# EAGLE design control-board-v0.2.1 (EAGLE 8.3.0)
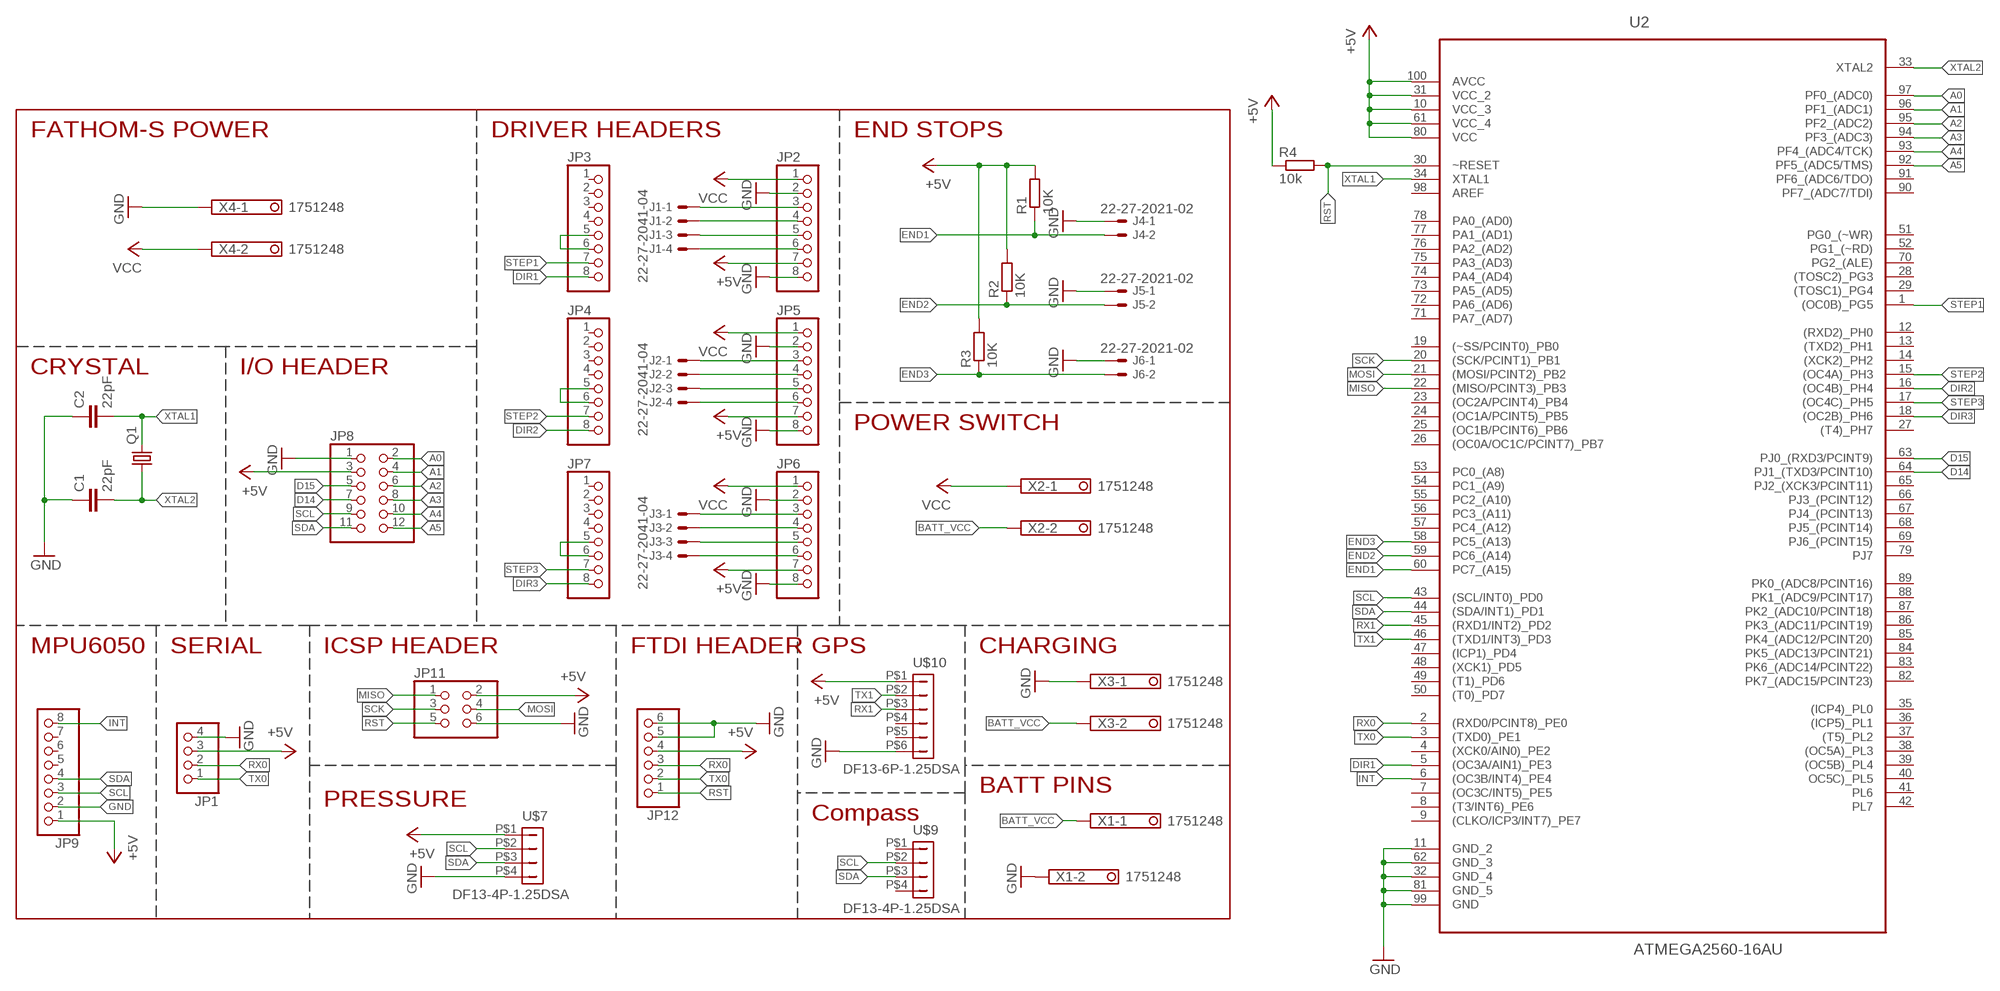
[diagram p0: schematic, sheet 1]

## Parts
C1  22pF  C-EUC0603  [C0603]
C2  22pF  C-EUC0603  [C0603]
J1  22-27-2041-04  [6410-04]
J2  22-27-2041-04  [6410-04]
J3  22-27-2041-04  [6410-04]
J4  22-27-2021-02  [6410-02]
J5  22-27-2021-02  [6410-02]
J6  22-27-2021-02  [6410-02]
JP1  PINHD-1X4  [1X04]
JP2  PINHD-1X8  [1X08]
JP3  PINHD-1X8  [1X08]
JP4  PINHD-1X8  [1X08]
JP5  PINHD-1X8  [1X08]
JP6  PINHD-1X8  [1X08]
JP7  PINHD-1X8  [1X08]
JP8  PINHD-2X6  [2X06]
JP9  PINHD-1X8  [1X08]
JP11  PINHD-2X3  [2X03]
JP12  PINHD-1X6  [1X06]
Q1  CRYSTALHC49U70  [HC49U70]
R1  10K  R-EU_R0603  [R0603]
R2  10K  R-EU_R0603  [R0603]
R3  10K  R-EU_R0603  [R0603]
R4  10k  R-EU_R0603  [R0603]
U2  ATMEGA2560-16AU  [QFP50P1600X1600X120-100N]
U$7  DF13-4P-1.25DSA  [DF13-4P-1.25DSA]
U$9  DF13-4P-1.25DSA  [DF13-4P-1.25DSA]
U$10  DF13-6P-1.25DSA  [DF13-6P-1.25DSA]
X1  1751248  [1751248]
X2  1751248  [1751248]
X3  1751248  [1751248]
X4  1751248  [1751248]

## Nets
+5V: JP1.3 JP2.7 JP5.7 JP6.7 JP8.3 JP9.1 JP11.2 JP12.4 R1.2 R2.2 R3.2 R4.1 U2.10(VCC_3) U2.31(VCC_2) U2.61(VCC_4) U2.80(VCC) U2.100(AVCC) U$7.P$1 U$10.P$1
A0: JP8.2 U2.97(PF0_(ADC0))
A1: JP8.4 U2.96(PF1_(ADC1))
A2: JP8.6 U2.95(PF2_(ADC2))
A3: JP8.8 U2.94(PF3_(ADC3))
A4: JP8.10 U2.93(PF4_(ADC4/TCK))
A5: JP8.12 U2.92(PF5_(ADC5/TMS))
BATT_VCC: X1.1 X2.2 X3.2
D14: JP8.7 U2.64(PJ1_(TXD3/PCINT10))
D15: JP8.5 U2.63(PJ0_(RXD3/PCINT9))
DIR1: JP3.8 U2.5((OC3A/AIN1)_PE3)
DIR2: JP4.8 U2.16((OC4B)_PH4)
DIR3: JP7.8 U2.18((OC2B)_PH6)
END1: J4.2 R1.1 U2.60(PC7_(A15))
END2: J5.2 R2.1 U2.59(PC6_(A14))
END3: J6.2 R3.1 U2.58(PC5_(A13))
GND: C1.1 C2.1 J4.1 J5.1 J6.1 JP1.4 JP2.2 JP2.8 JP5.2 JP5.8 JP6.2 JP6.8 JP8.1 JP9.2 JP11.6 JP12.5 JP12.6 U2.11(GND_2) U2.32(GND_4) U2.62(GND_3) U2.81(GND_5) U2.99(GND) U$7.P$4 U$10.P$6 X1.2 X3.1 X4.1
INT: JP9.8 U2.6((OC3B/INT4)_PE4)
MISO: JP11.1 U2.22((MISO/PCINT3)_PB3)
MOSI: JP11.4 U2.21((MOSI/PCINT2)_PB2)
N$1: JP3.5 JP3.6
N$2: JP4.5 JP4.6
N$3: J1.4 JP2.6
N$4: JP7.5 JP7.6
N$5: J1.3 JP2.5
N$6: J1.2 JP2.4
N$7: J1.1 JP2.3
N$8: J2.4 JP5.6
N$9: J2.3 JP5.5
N$10: J2.2 JP5.4
N$11: J2.1 JP5.3
N$12: J3.4 JP6.6
N$13: J3.3 JP6.5
N$14: J3.2 JP6.4
N$15: J3.1 JP6.3
RST: JP11.5 JP12.1 R4.2 U2.30(~RESET)
RX0: JP1.2 JP12.3 U2.2((RXD0/PCINT8)_PE0)
RX1: U2.45((RXD1/INT2)_PD2) U$10.P$3
SCK: JP11.3 U2.20((SCK/PCINT1)_PB1)
SCL: JP8.9 JP9.3 U2.43((SCL/INT0)_PD0) U$7.P$2 U$9.P$2
SDA: JP8.11 JP9.4 U2.44((SDA/INT1)_PD1) U$7.P$3 U$9.P$3
STEP1: JP3.7 U2.1((OC0B)_PG5)
STEP2: JP4.7 U2.15((OC4A)_PH3)
STEP3: JP7.7 U2.17((OC4C)_PH5)
TX0: JP1.1 JP12.2 U2.3((TXD0)_PE1)
TX1: U2.46((TXD1/INT3)_PD3) U$10.P$2
VCC: JP2.1 JP5.1 JP6.1 X2.1 X4.2
XTAL1: C2.2 Q1.2 U2.34(XTAL1)
XTAL2: C1.2 Q1.1 U2.33(XTAL2)
Unconnected: JP3.1 JP3.2 JP3.3 JP3.4 JP4.1 JP4.2 JP4.3 JP4.4 JP7.1 JP7.2 JP7.3 JP7.4 JP9.5 JP9.6 JP9.7 U2.4((XCK0/AIN0)_PE2) U2.7((OC3C/INT5)_PE5) U2.8((T3/INT6)_PE6) U2.9((CLKO/ICP3/INT7)_PE7) U2.12((RXD2)_PH0) U2.13((TXD2)_PH1) U2.14((XCK2)_PH2) U2.19((~SS/PCINT0)_PB0) U2.23((OC2A/PCINT4)_PB4) U2.24((OC1A/PCINT5)_PB5) U2.25((OC1B/PCINT6)_PB6) U2.26((OC0A/OC1C/PCINT7)_PB7) U2.27((T4)_PH7) U2.28((TOSC2)_PG3) U2.29((TOSC1)_PG4) U2.35((ICP4)_PL0) U2.36((ICP5)_PL1) U2.37((T5)_PL2) U2.38((OC5A)_PL3) U2.39((OC5B)_PL4) U2.40(OC5C)_PL5) U2.41(PL6) U2.42(PL7) U2.47((ICP1)_PD4) U2.48((XCK1)_PD5) U2.49((T1)_PD6) U2.50((T0)_PD7) U2.51(PG0_(~WR)) U2.52(PG1_(~RD)) U2.53(PC0_(A8)) U2.54(PC1_(A9)) U2.55(PC2_(A10)) U2.56(PC3_(A11)) U2.57(PC4_(A12)) U2.65(PJ2_(XCK3/PCINT11)) U2.66(PJ3_(PCINT12)) U2.67(PJ4_(PCINT13)) U2.68(PJ5_(PCINT14)) U2.69(PJ6_(PCINT15)) U2.70(PG2_(ALE)) U2.71(PA7_(AD7)) U2.72(PA6_(AD6)) U2.73(PA5_(AD5)) U2.74(PA4_(AD4)) U2.75(PA3_(AD3)) U2.76(PA2_(AD2)) U2.77(PA1_(AD1)) U2.78(PA0_(AD0)) U2.79(PJ7) U2.82(PK7_(ADC15/PCINT23)) U2.83(PK6_(ADC14/PCINT22)) U2.84(PK5_(ADC13/PCINT21)) U2.85(PK4_(ADC12/PCINT20)) U2.86(PK3_(ADC11/PCINT19)) U2.87(PK2_(ADC10/PCINT18)) U2.88(PK1_(ADC9/PCINT17)) U2.89(PK0_(ADC8/PCINT16)) U2.90(PF7_(ADC7/TDI)) U2.91(PF6_(ADC6/TDO)) U2.98(AREF) U$9.P$1 U$9.P$4 U$10.P$4 U$10.P$5

## Notes on the sheet
- FATHOM-S POWER | DRIVER HEADERS | END STOPS
- CRYSTAL | I/O HEADER
- POWER SWITCH
- MPU6050 | SERIAL | ICSP HEADER | FTDI HEADER | GPS | CHARGING
- BATT PINS
- PRESSURE
- Compass

## Library data of the parts
C1 C2 = rcl:C-EU: CAPACITOR, European symbol
J1-J3 = EP_molex_6410_7395:22-?-04: CONNECTOR wire to board 2.54 mm (.1 inch) pitch header
J4-J6 = EP_molex_6410_7395:22-?-02: CONNECTOR wire to board 2.54 mm (.1 inch) pitch header
JP1 = pinhead:PINHD-1X4: PIN HEADER
JP2-JP7 JP9 = pinhead:PINHD-1X8: PIN HEADER
JP8 = pinhead:PINHD-2X6: PIN HEADER
JP11 = pinhead:PINHD-2X3: PIN HEADER
JP12 = pinhead:PINHD-1X6: PIN HEADER
Q1 = crystal:CRYSTAL: CRYSTAL; OC_FARNELL: unknown; OC_NEWARK: unknown
R1-R4 = rcl:R-EU_: RESISTOR, European symbol
U2 = Atmel_By_element14_Batch_1-00:ATMEGA2560-16AU: Microcontroller; DESCRIPTION: Microcontroller; MPN: ATMEGA2560-16AU; OC_FARNELL: 1288330; OC_NEWARK: 23M5051; PACKAGE: LQFP-100; SUPPLIER: ATMEL
U$7 U$9 = con-hirose-df13-4p:DF13-4P-1.25: DF13-4P 1.25mm Pitch Miniature Crimping Connector.
U$10 = con-hirose-df13-4p:DF13-6P-1.25: DF13-6P 1.25mm Pitch Miniature Crimping Connector.
X1-X4 = con-phoenix-350:1751248: MKDS 1/ 2-3,5 Printklemme Nennstrom: 10 A Bemessungsspannung: 160 V Raster: 3,5 mm Polzahl: 2 Montageart: Löten Anschlussart: Schraubanschluss Anschlussrichtung vom Leiter zur Platine: 0° Source: http://eshop.phoenixcontact.com .. 1751248.pdf; OC_FARNELL: unknown; OC_NEWARK: unknown

## Board
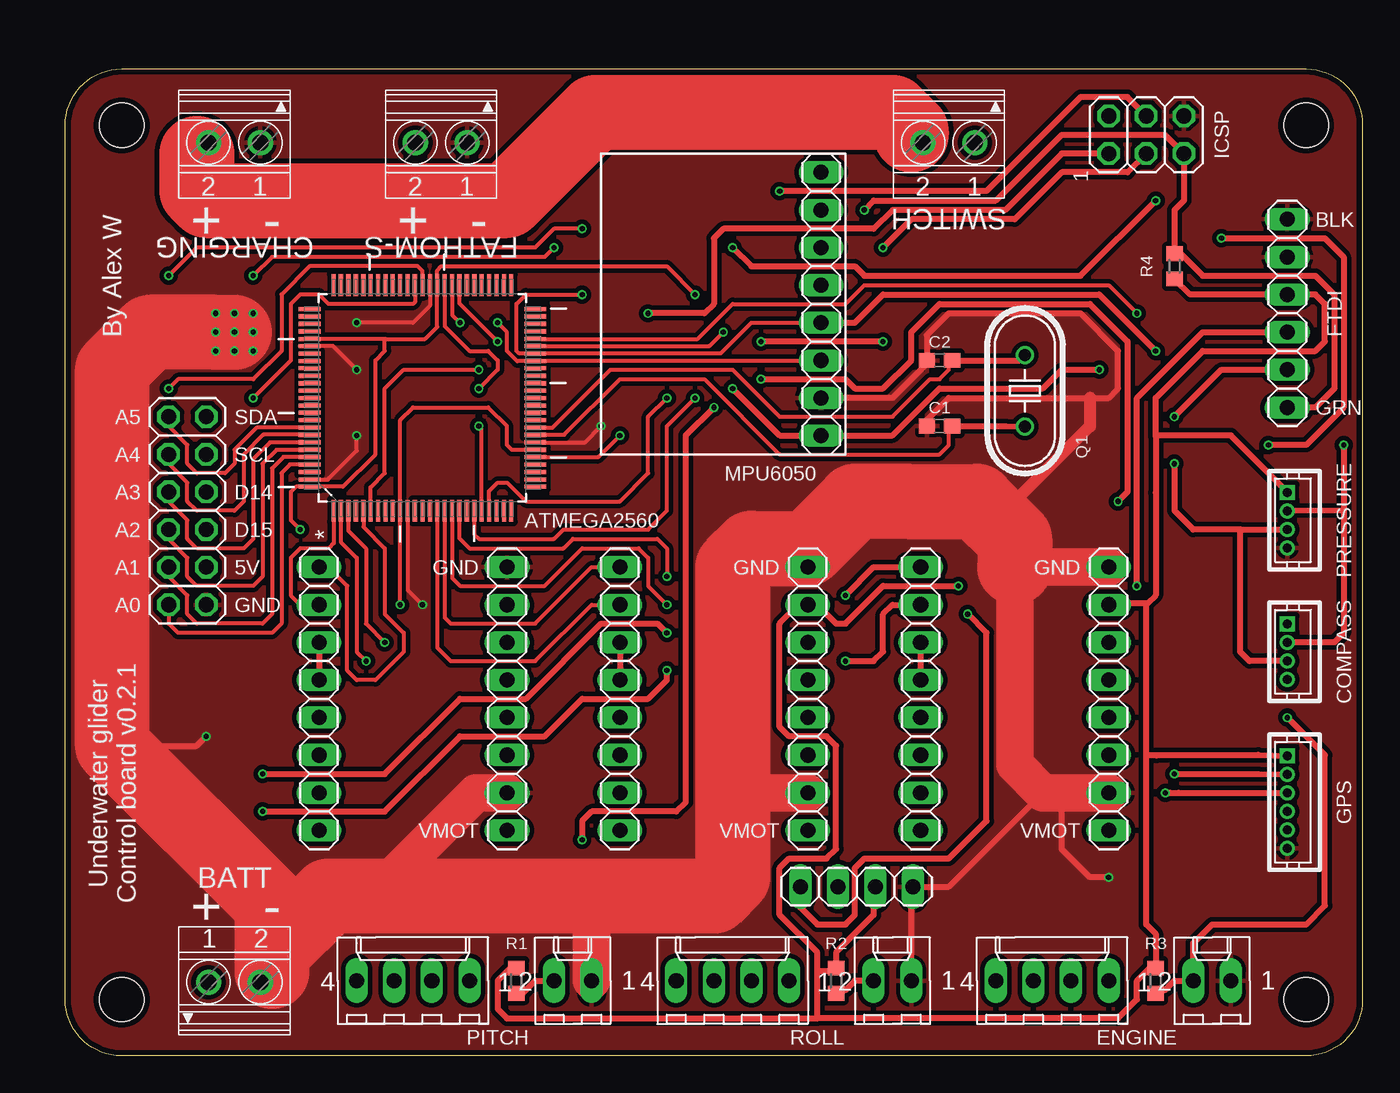
[diagram p1: board, top side]
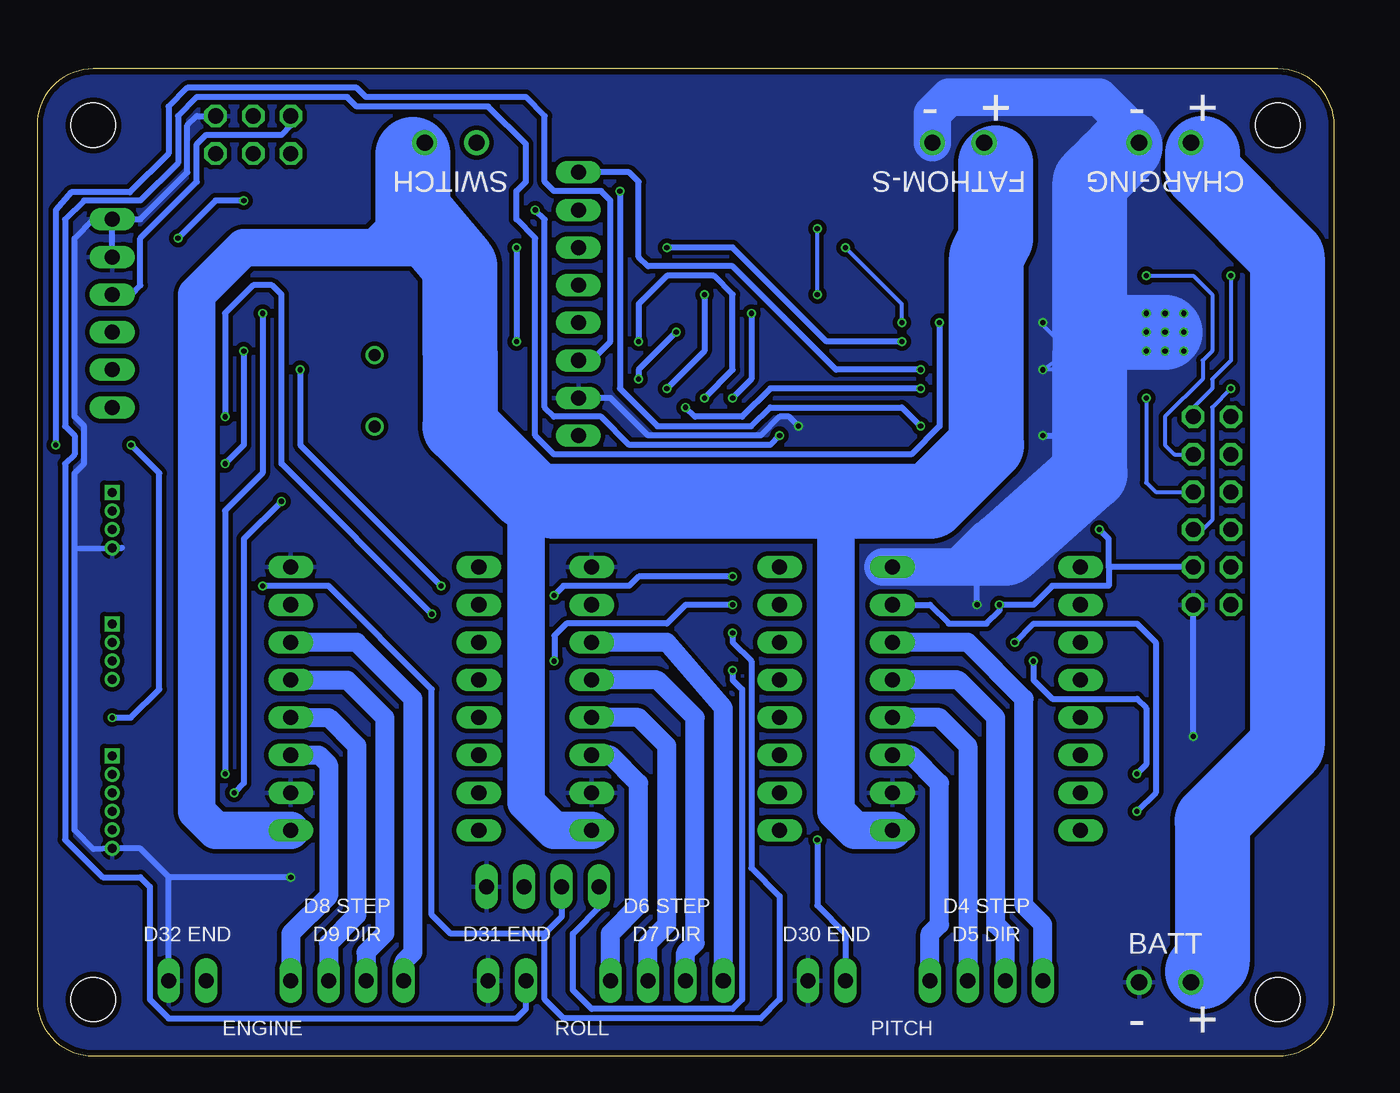
[diagram p2: board, bottom side, seen from below]

Size 87.63 x 66.67 mm. Coordinates in mm from the lower left corner, seen from the top.
Outline: 0,3.81 0,62.87 arc-90 3.81,66.67 83.82,66.67 arc-90 87.63,62.87 87.63,3.81 arc-90 83.82,0 3.81,0 arc-90 0,3.81
Copper layers (1*16): Top 0.035559375mm / dielectric 1.6mm / Bottom 0.035559375mm
Design rules "oshpark-2layer": minimum track width 6mil, minimum drill 10mil, track to track 6mil, track to pad 6mil, pad to pad 6mil, via to via 6mil, smd to smd 6mil, copper to edge 15mil, drill to drill 6mil, minimum pad ring 5mil, minimum via ring 5mil, stop-mask expansion 2.5mil, vias tented up to drill 0mil, thermal gap 10mil
Holes 3 mm at 3.81,3.81 83.82,3.81 3.81,62.87 83.82,62.87

### Footprints (pad centres in the part's own frame; a part is rotated, then mirrored left to right if it is on the bottom)
C0603 = smd 1.1 x 1: 1 -0.85,0; 2 0.85,0
6410-04 = drill 1.016 long: 1 3.81,0; 2 1.27,0; 3 -1.27,0; 4 -3.81,0
6410-02 = drill 1.016 long: 1 1.27,0; 2 -1.27,0
1X04 = drill 1.016 long: 1 -3.81,0; 2 -1.27,0; 3 1.27,0; 4 3.81,0
1X08 = drill 1.016 long: 1 -8.89,0; 2 -6.35,0; 3 -3.81,0; 4 -1.27,0; 5 1.27,0; 6 3.81,0; 7 6.35,0; 8 8.89,0
2X06 = drill 1.016 octagon: 1 -6.35,-1.27; 2 -6.35,1.27; 3 -3.81,-1.27; 4 -3.81,1.27; 5 -1.27,-1.27; 6 -1.27,1.27; 7 1.27,-1.27; 8 1.27,1.27; 9 3.81,-1.27; 10 3.81,1.27; 11 6.35,-1.27; 12 6.35,1.27
2X03 = drill 1.016 octagon: 1 -2.54,-1.27; 2 -2.54,1.27; 3 0,-1.27; 4 0,1.27; 5 2.54,-1.27; 6 2.54,1.27
1X06 = drill 1.016 long: 1 -6.35,0; 2 -3.81,0; 3 -1.27,0; 4 1.27,0; 5 3.81,0; 6 6.35,0
HC49U70 = drill 0.813: 1 -2.413,0; 2 2.413,0
R0603 = smd 1 x 1.1: 1 -0.85,0; 2 0.85,0
QFP50P1600X1600X120-100N = smd 1.473 x 0.279: 1 -7.62,5.994; 2 -7.62,5.512; 3 -7.62,5.004; 4 -7.62,4.496; 5 -7.62,3.988; 6 -7.62,3.505; 7 -7.62,2.997; 8 -7.62,2.489; 9 -7.62,2.007; 10 -7.62,1.499; 11 -7.62,0.991; 12 -7.62,0.508; 13 -7.62,0; 14 -7.62,-0.508; 15 -7.62,-0.991; 16 -7.62,-1.499; 17 -7.62,-2.007; 18 -7.62,-2.489; 19 -7.62,-2.997; 20 -7.62,-3.505; 21 -7.62,-3.988; 22 -7.62,-4.496; 23 -7.62,-5.004; 24 -7.62,-5.512; 25 -7.62,-5.994; 51 7.62,-5.994; 52 7.62,-5.512; 53 7.62,-5.004; 54 7.62,-4.496; 55 7.62,-3.988; 56 7.62,-3.505; 57 7.62,-2.997; 58 7.62,-2.489; 59 7.62,-2.007; 60 7.62,-1.499; 61 7.62,-0.991; 62 7.62,-0.508; 63 7.62,0; 64 7.62,0.508; 65 7.62,0.991; 66 7.62,1.499; 67 7.62,2.007; 68 7.62,2.489; 69 7.62,2.997; 70 7.62,3.505; 71 7.62,3.988; 72 7.62,4.496; 73 7.62,5.004; 74 7.62,5.512; 75 7.62,5.994 | smd 0.279 x 1.473: 26 -5.994,-7.62; 27 -5.512,-7.62; 28 -5.004,-7.62; 29 -4.496,-7.62; 30 -3.988,-7.62; 31 -3.505,-7.62; 32 -2.997,-7.62; 33 -2.489,-7.62; 34 -2.007,-7.62; 35 -1.499,-7.62; 36 -0.991,-7.62; 37 -0.508,-7.62; 38 0,-7.62; 39 0.508,-7.62; 40 0.991,-7.62; 41 1.499,-7.62; 42 2.007,-7.62; 43 2.489,-7.62; 44 2.997,-7.62; 45 3.505,-7.62; 46 3.988,-7.62; 47 4.496,-7.62; 48 5.004,-7.62; 49 5.512,-7.62; 50 5.994,-7.62; 76 5.994,7.62; 77 5.512,7.62; 78 5.004,7.62; 79 4.496,7.62; 80 3.988,7.62; 81 3.505,7.62; 82 2.997,7.62; 83 2.489,7.62; 84 2.007,7.62; 85 1.499,7.62; 86 0.991,7.62; 87 0.508,7.62; 88 0,7.62; 89 -0.508,7.62; 90 -0.991,7.62; 91 -1.499,7.62; 92 -2.007,7.62; 93 -2.489,7.62; 94 -2.997,7.62; 95 -3.505,7.62; 96 -3.988,7.62; 97 -4.496,7.62; 98 -5.004,7.62; 99 -5.512,7.62; 100 -5.994,7.62
DF13-4P-1.25DSA = drill 0.6 pad 1.016 square: P$1 1.875,0 | drill 0.6 pad 1.016: P$2 0.625,0; P$3 -0.625,0; P$4 -1.875,0
DF13-6P-1.25DSA = drill 0.6 pad 1.016 square: P$1 3.125,0 | drill 0.6 pad 1.016: P$2 1.875,0; P$3 0.625,0; P$4 -0.625,0; P$5 -1.875,0; P$6 -3.125,0
1751248 = drill 1.1 pad 1.7: 1 -1.75,-0.1; 2 1.75,-0.1

### Placement (x,y rotation side)
C1  59.05,42.55 0 top
C2  59.05,46.99 0 top
J1  23.49,5.08 0 top
J2  45.09,5.08 0 top
J3  66.67,5.08 0 top
J4  34.29,5.08 0 top
J5  55.88,5.08 0 top
J6  77.47,5.08 0 top
JP1  53.47,11.43 0 top
JP2  29.84,24.13 90 top
JP3  17.14,24.13 90 top
JP4  37.47,24.13 90 top
JP5  50.16,24.13 90 top
JP6  70.48,24.13 90 top
JP7  57.79,24.13 90 top
JP8  8.26,36.83 90 top
JP9  51.05,50.8 90 top
JP11  73.02,62.23 0 top
JP12  82.55,50.16 90 top
Q1  64.83,44.94 90 top
R1  30.48,5.08 90 top
R2  52.07,5.08 90 top
R3  73.66,5.08 90 top
R4  74.93,53.34 90 top
U2  24.13,44.45 90 top
U$7  82.55,36.2 90 top
U$9  82.55,27.3 90 top
U$10  82.55,17.14 90 top
X1  11.43,5.08 0 top
X2  59.69,61.59 180 top
X3  11.43,61.59 180 top
X4  25.4,61.59 180 top

### Tracks (layer width: path | path; a pad name or v marks a point on that pad's centre or on a via)
+5V  (via drill 0.35)
  Top 0.279: v22.63,30.48 U2.10 22.63,42.95 23.49,43.82 28.57,43.82 29.84,42.55 29.84,41.27 30.17,40.95 U2.31 | 21.63,48.44 U2.80 | 21.63,48.44 24.31,48.44 25.12,49.25 U2.61 25.12,53.06 25.4,53.34 40.64,53.34 v42.55,51.44 | 21.63,48.44 21.59,48.4 21.59,47.62 20.95,46.99 20.95,40.64 18.77,38.46 U2.100 15.6,38.46 15.24,38.1 15.24,36.2 v15.88,35.56
  Top 0.406: 50.8,2.54 71.12,2.54 72.39,3.81 72.39,5.08 73.24,5.93 R3.2 73.66,8.26 73.02,8.89 73.02,20.34 | 50.8,2.54 50.8,5.71 | 50.8,2.54 29.84,2.54 29.21,3.17 29.21,5.08 30.06,5.93 R1.2 | 50.8,5.71 52.07,5.71 R2.2 52.07,6.99 54.61,9.53 54.61,11.3 JP1.3 54.61,11.43 | 50.8,5.71 50.8,6.99 48.26,9.53 48.26,12.7 48.9,13.34 51.44,13.34 52.07,13.97 52.07,20.95 51.44,21.59 48.9,21.59 48.26,22.22 48.26,29.21 49.53,30.48 JP5.7 50.8,30.48 52.07,29.21 52.71,29.21 55.25,31.75 v60.33,31.75 | 73.02,20.34 73.02,30.57 | 73.66,38.04 73.66,31.11 73.11,30.57 73.02,30.57 | 73.66,41.87 73.66,38.04 | 73.66,41.87 73.66,44.45 76.83,47.62 84.45,47.62 85.09,48.26 85.09,50.8 84.45,51.44 JP12.4 75.98,51.44 R4.1 | 73.69,38.07 73.66,38.04 | 73.73,20.27 73.02,20.34 | 73.02,20.34 80.58,20.34 U$10.P$1 | 73.02,30.57 70.57,30.57 JP6.7 | U$7.P$1 82.55,38.1 78.74,41.91 73.7,41.91 73.66,41.87 | v69.85,46.36 67.31,46.36 66.04,45.09 59.05,45.09 55.88,41.91 JP9.1 48.26,41.91 v45.09,45.09
  Bottom 0.406: JP2.7 27.3,30.48 26.04,29.21 23.49,29.21 22.63,30.07 v22.63,30.48 20.32,30.48 19.05,31.75 15.24,31.75 15.24,33.02 | 15.24,33.02 15.24,34.93 v15.88,35.56 | JP12.4 81.28,51.44 80.64,52.07 80.64,55.25 76.83,59.05 76.83,61.59 76.2,62.23 71.12,62.23 70.48,62.87 JP11.2 | v69.85,46.36 69.85,41.27 v60.33,31.75 | v42.55,51.44 42.55,47.62 v45.09,45.09 | JP8.3 15.24,33.02
A0
  Top 0.279: U2.97 15.19,39.95 14.61,39.37 14.61,29.21 13.97,28.57 7.62,28.57 6.99,29.21 JP8.2
A1
  Top 0.279: U2.96 14.75,40.46 13.97,39.69 13.97,29.84 13.34,29.21 8.89,29.21 8.26,29.84 8.26,31.11 6.99,32.39 JP8.4
A2
  Top 0.279: U2.95 14.28,40.95 13.34,40.01 13.34,32.39 12.7,31.75 8.89,31.75 8.26,32.39 8.26,33.66 6.99,34.93 JP8.6
A3
  Top 0.279: U2.94 13.83,41.45 12.7,40.32 12.7,34.93 12.06,34.29 8.89,34.29 8.26,34.93 8.26,36.2 6.99,37.47 JP8.8
A4
  Top 0.279: U2.93 13.39,41.96 12.06,40.64 12.06,37.47 11.43,36.83 8.89,36.83 8.26,37.47 8.26,38.73 6.99,40.01 JP8.10
A5
  Top 0.279: U2.92 12.92,42.44 11.43,40.96 11.43,40.01 10.79,39.37 8.89,39.37 8.26,40.01 8.26,41.27 6.99,42.55 JP8.12
BATT_VCC
  Top 0.508: 57.15,62.23 57.69,61.7 X2.2
  Top 2.54: X3.2 8.95,60.96 8.89,60.96
  Top 5.08: 8.89,60.96 8.89,58.42 9.53,57.79 29.84,57.79 35.81,63.75 55.88,63.75 57.15,62.48 57.15,62.23
  Bottom 0.406: 9.53,61.54 X3.2 8.95,60.96 8.89,60.96 | 8.89,5.71 8.95,5.71 X1.1
  Bottom 5.08: 8.89,60.96 8.89,59.69 3.17,53.98 3.17,20.95 8.26,15.88 8.26,6.35 8.89,5.71
D14  (via drill 0.35)
  Top 0.279: U2.64 23.62,50.93 23.49,50.8 17.78,50.8 17.14,51.44 15.88,51.44 15.24,50.8 15.24,46.99 v12.7,44.45
  Bottom 0.279: v12.7,44.45 12.7,38.73 12.06,38.1 JP8.7
D15  (via drill 0.35)
  Top 0.279: U2.63 24.13,53.02 23.81,53.34 16.51,53.34 14.61,51.44 14.61,47.62 12.7,45.72 7.62,45.72 v6.99,45.09
  Bottom 0.279: v6.99,45.09 v6.99,45.08 8.26,43.82 8.26,36.2 8.89,35.56 JP8.5
DIR1
  Top 0.279: U2.5 20.14,35.74 21.59,34.29 21.59,29.84 22.86,28.57 22.86,27.3 20.95,25.4 19.68,25.4 19.05,26.04 19.05,31.75 17.78,33.02 JP3.8
DIR2
  Top 0.279: U2.16 25.63,29.62 26.04,29.21 31.75,29.21 35.56,33.02 JP4.8
DIR3  (via drill 0.35)
  Top 0.279: U2.18 26.62,34.98 27.3,34.29 33.66,34.29 34.29,34.93 40.01,34.93 40.64,34.29 v40.64,32.39
  Top 0.406: v52.71,31.11 54.61,33.02 JP7.8
  Bottom 0.406: v40.64,32.39 46.99,32.39 47.62,31.75 52.07,31.75 v52.71,31.11
END1  (via drill 0.35)
  Top 0.279: U2.60 25.63,49.3 27.3,47.62 28.57,47.62 29.21,46.99 29.21,46.36 v27.94,45.09
  Top 0.406: R1.1 30.9,4.23 31.75,5.08 J4.2 | v43.82,43.82 41.91,41.91 41.91,17.14 41.27,16.51 35.56,16.51 34.93,15.88 v34.93,14.61
  Bottom 0.406: v27.94,45.09 38.1,45.09 40.01,43.18 43.18,43.18 v43.82,43.82 | v34.93,14.61 34.93,10.16 33.02,8.26 J4.2
END2  (via drill 0.35)
  Top 0.279: U2.59 26.14,50.06 v26.67,49.53
  Top 0.406: J5.2 53.34,5.08 52.71,4.45 R2.1
  Bottom 0.406: v26.67,49.53 26.67,42.55 28.57,40.64 52.71,40.64 53.98,41.91 53.98,55.25 55.25,56.52 55.25,58.42 54.61,59.05 54.61,61.59 57.15,64.13 66.04,64.13 66.67,64.77 76.83,64.77 78.1,63.5 78.1,60.33 80.64,57.79 84.45,57.79 85.72,56.52 85.72,42.55 85.09,41.91 85.09,40.64 85.72,40.01 85.72,14.61 83.18,12.06 80.64,12.06 80.01,11.43 80.01,3.81 78.74,2.54 55.25,2.54 54.61,3.17 J5.2
END3  (via drill 0.35)
  Top 0.279: U2.58 26.62,50.85 v29.21,48.26
  Top 0.406: R3.1 74.3,4.45 74.93,5.08 J6.2 76.2,7.62 77.47,8.89 83.82,8.89 85.09,10.16 85.09,20.32 v82.56,22.85 | v78.1,55.25 85.09,55.25 86.36,53.98 86.36,43.82 83.82,41.27 v81.28,41.27 | v45.09,54.61 46.36,53.34 53.34,53.34 53.98,52.71 68.58,52.71 v73.66,57.79
  Bottom 0.406: v29.21,48.26 34.29,48.26 40.64,54.61 v45.09,54.61 | v82.56,22.85 81.29,22.85 79.38,24.76 79.38,39.37 v81.28,41.27 | v73.66,57.79 75.56,57.79 v78.1,55.25
GND  (via drill 0.35)
  Top 0.279: U2.99 17.73,38.94 19.68,40.89 v19.68,41.91 | U2.81 18.08,47.96 v19.68,46.36 | U2.62 24.64,50.67 23.49,49.53 v19.68,49.53 | U2.11 23.14,31.47 v24.13,30.48 | U2.32 35.1,41.45 v36.2,42.55 | v10.16,50.16 v10.16,48.9
  Top 0.406: J5.1 57.15,11.3 JP1.4 59.69,11.43 66.04,17.78 67.31,16.51 67.31,13.97 69.21,12.06 v70.48,12.06 | 56.94,37.51 56.89,37.47 | C1.1 58.21,42.97 59.69,44.45 69.21,44.45 70.48,44.45 71.12,45.09 71.12,47.62 68.58,50.16 59.69,50.16 58.21,48.68 C2.1 58.42,46.99 55.88,44.45 JP9.2 | 62.87,36.2 64.13,34.93 | 3.17,20.95 8.89,20.95 v9.53,21.59
  Top 0.813: 62.87,36.2 69.21,42.55 69.21,44.45
  Top 2.54: X1.2 13.23,4.98 13.97,5.71 | 43.82,10.79 43.82,17.78 JP5.2 | JP2.2 27.74,17.78 20.75,10.79 | J4.1 35.56,10.74 35.62,10.79 | JP5.8 46.36,34.29 | JP6.8 64.77,33.02 64.77,34.29 64.13,34.93 64.13,19.68 66.04,17.78 JP6.2
  Top 5.08: 13.97,5.71 13.97,6.99 | 13.97,6.99 17.78,10.79 20.75,10.79 35.62,10.79 43.82,10.79 45.09,12.06 45.09,33.02 46.36,34.29 50.16,34.29 53.34,37.47 56.89,37.47 61.59,37.47 64.13,34.93 64.13,33.02 | 13.97,6.99 13.97,10.16 3.17,20.95 3.17,46.36 5.71,48.9 v10.16,48.9 v11.43,48.9
  Bottom 0.279: 16.51,47.62 17.78,46.36 v19.68,46.36 17.93,47.62 | 17.93,47.62 16.51,46.84 | v19.68,49.53 19.68,49.38 17.93,47.62 | 24.13,32.99 24.16,33.02
  Bottom 0.406: JP12.6 80.64,56.52 77.47,59.69 77.47,62.87 76.83,63.5 JP11.6 | U$7.P$4 81.88,34.32 85.09,34.29 | 85.09,34.29 85.09,39.37 84.45,40.01 84.45,42.55 85.09,43.18 85.09,55.25 83.82,56.52 JP12.6 | 85.09,34.29 85.09,15.24 83.82,13.97 U$10.P$6 80.65,14.02 78.74,12.11 | J6.1 78.74,12.11 | v19.68,41.91 18.41,41.91 18.41,39.37 16.51,39.37 | v24.13,30.48 24.13,32.99 | 78.74,12.11 70.53,12.11 v70.48,12.06 | v36.2,42.55 36.83,43.18 37.47,43.18 38.73,41.91 46.36,41.91 48.9,44.45 JP9.2 | JP12.5 JP12.6 | v9.53,21.59 JP8.1 | 15.24,60.33 14.55,60.33 X3.1
  Bottom 2.54: 22.22,34.29 22.22,33.02 23.49,33.02 23.49,34.93 25.4,33.02 | 25.4,33.02 24.16,33.02 22.86,33.02 | 25.4,33.02 JP2.8 30.48,33.02 | X3.1 13.18,62.08 15.88,64.77 26.04,64.77 27.15,63.66 X4.1
  Bottom 5.08: 16.51,48.9 16.51,59.05 15.24,60.33 14.12,61.44 | 22.22,34.29 16.51,39.37 16.51,46.84 16.51,47.62 16.51,48.9 | 16.51,48.9 v11.43,48.9
  pour Bottom (isolate 0.305): -5.08,70.48 87.63,70.48 97.16,60.96 97.16,5.08 86.36,-5.71 -1.27,-5.71 -8.26,1.27 -7.62,66.04
  pour Top (isolate 0.305): -6.35,65.41 -1.27,69.21 86.36,69.21 93.34,62.23 93.34,6.35 85.72,-2.54 -1.91,-1.91 -6.35,2.54
INT  (via drill 0.35)
  Top 0.279: U2.6 20.62,38.41 21.59,39.37 21.59,45.09 22.86,46.36 v27.94,46.36
  Bottom 0.406: v27.94,46.36 33.66,46.36 40.64,53.34 46.36,53.34 46.99,53.98 46.99,59.05 47.62,59.69 JP9.8
MISO  (via drill 0.35)
  Top 0.279: U2.22 28.63,38.15 29.21,38.73 29.84,38.73 31.11,37.47 37.47,37.47 39.37,39.37 39.37,43.18 v40.64,44.45
  Top 0.406: JP11.1 67.31,60.96 63.5,57.15 55.88,57.15 54.61,55.88 44.45,55.88 43.82,55.25 43.82,50.8 43.18,50.16 v39.37,50.16
  Bottom 0.406: v39.37,50.16 39.37,45.72 v40.64,44.45
MOSI  (via drill 0.35)
  Top 0.279: U2.21 28.12,42.37 v27.94,42.55
  Top 0.406: JP11.4 71.75,64.77 68.58,64.77 62.23,58.42 v48.26,58.42
  Bottom 0.406: v48.26,58.42 48.26,45.09 45.72,42.55 39.37,42.55 38.1,43.82 29.21,43.82 v27.94,42.55
N$1
  Top 0.406: JP3.6 JP3.5
N$2
  Top 0.406: JP4.6 JP4.5
N$3
  Bottom 1.27: J1.4 19.68,8.89 20.95,10.16 20.95,24.13 24.76,27.94 JP2.6
N$4
  Top 0.406: JP7.6 JP7.5
N$5
  Bottom 1.27: J1.3 22.22,8.26 22.86,8.89 22.86,22.86 25.4,25.4 JP2.5
N$6
  Bottom 1.27: J1.2 24.76,20.95 26.67,22.86 JP2.4
N$7
  Bottom 1.27: J1.1 27.3,8.26 26.67,8.89 26.67,18.41 28.57,20.32 JP2.3
N$8
  Bottom 1.27: J2.4 41.27,23.49 45.09,27.94 JP5.6
N$9
  Bottom 1.27: J2.3 43.82,6.99 43.18,7.62 43.18,22.86 45.72,25.4 JP5.5
N$10
  Bottom 1.27: J2.2 46.36,7.62 45.09,8.89 45.09,20.95 46.99,22.86 JP5.4
N$11
  Bottom 1.27: J2.1 48.9,8.26 46.99,10.16 46.99,18.41 48.9,20.32 JP5.3
N$12
  Bottom 1.27: J3.4 62.87,6.35 62.23,6.99 62.23,24.13 66.04,27.94 JP6.6
N$13
  Bottom 1.27: JP6.5 66.67,25.4 64.13,22.86 64.13,8.26 65.41,6.99 J3.3
N$14
  Bottom 1.27: JP6.4 67.94,22.86 66.04,20.95 66.04,9.53 67.94,7.62 J3.2
N$15
  Bottom 1.27: JP6.3 68.58,20.32 67.94,19.68 67.94,10.79 70.48,8.26 J3.1
N$16  (via drill 0.35)
  other vias: 11.43,50.16
N$17  (via drill 0.35)
  other vias: 12.7,50.16
N$18  (via drill 0.35)
  other vias: 10.16,47.62
N$19  (via drill 0.35)
  other vias: 12.7,47.62
N$20  (via drill 0.35)
  other vias: 12.7,48.9
N$21  (via drill 0.35)
  other vias: 11.43,47.62
N$23
  pour Top (isolate 0.305): 3.81,66.67 83.82,66.67 arc-90 87.63,62.87 87.63,3.81 arc-90 83.82,0 3.81,0 arc-90 0,3.81 0,62.87 arc-90
N$24
  pour Bottom (isolate 0.305): 3.81,66.67 83.82,66.67 arc-90 87.63,62.87 87.63,3.81 arc-90 83.82,0 3.81,0 arc-90 0,3.81 0,62.23 arc-90
RST  (via drill 0.35)
  Top 0.279: U2.30 36.02,40.46 v37.47,41.91
  Top 0.406: JP12.1 84.45,43.82 85.72,45.09 85.72,51.44 84.45,52.71 76.83,52.71 75.35,54.19 R4.2 74.93,57.15 75.56,57.79 JP11.5 74.3,62.23 67.31,62.23 62.87,57.79 54.61,57.79 v53.98,57.15
  Bottom 0.406: v37.47,41.91 38.1,41.27 47.62,41.27 49.53,43.18 52.71,43.18 53.34,43.82 53.34,56.52 v53.98,57.15
RX0  (via drill 0.35)
  Top 0.279: U2.2 18.62,34.72 19.68,33.66 19.68,27.3 v20.32,26.67
  Top 0.406: v72.39,31.75 72.39,44.45 76.83,48.9 JP12.3 | v13.34,19.05 21.59,19.05 26.67,24.13 31.11,24.13 36.2,29.21 40.01,29.21 v40.64,28.57
  Bottom 0.406: JP1.2 52.2,9.4 53.34,8.26 53.4,8.26 | 53.4,8.26 59.69,8.26 60.96,9.53 60.96,24.76 67.94,31.75 v72.39,31.75 | v20.32,26.67 20.32,25.4 19.05,24.13 13.34,24.13 12.7,23.49 12.7,19.68 v13.34,19.05 | v40.64,28.57 40.64,27.94 39.37,26.67 39.37,12.7 37.47,10.79 37.47,3.81 38.73,2.54 52.07,2.54 53.34,3.81 53.34,8.19 53.4,8.26
RX1  (via drill 0.35)
  Top 0.279: U2.45 43.51,47.96 v44.45,48.9
  Top 0.406: v46.99,45.72 52.71,45.72 53.34,45.09 55.25,45.09 57.15,46.99 57.15,48.9 59.05,50.8 69.21,50.8 71.75,48.26 71.75,38.1 v71.12,37.47 | v74.32,17.78 74.63,17.78 74.66,17.76 75.2,17.76 75.21,17.77 U$10.P$3
  Bottom 0.406: v44.45,48.9 46.99,46.36 v46.99,45.72 | v71.12,37.47 73.66,34.93 73.66,18.41 74.3,17.78 v74.32,17.78
SCK  (via drill 0.35)
  Top 0.279: U2.20 27.63,35.23 27.94,34.93 33.02,34.93 33.66,35.56 39.37,35.56 40.64,36.83 40.64,42.55 v42.55,44.45
  Top 0.406: JP11.3 71.75,59.69 67.31,59.69 64.13,56.52 57.15,56.52 v55.25,54.61 | v55.25,48.26 v46.99,48.26
  Bottom 0.406: v42.55,44.45 40.64,46.36 40.64,51.44 41.91,52.71 45.09,52.71 46.99,50.8 v46.99,48.26 | v55.25,54.61 v55.25,48.26
SCL  (via drill 0.35)
  Top 0.279: JP9.3 51,46.94 U2.43 30.53,46.94 29.84,47.62 29.84,48.9 v29.21,49.53 | v33.02,54.61 32.39,53.98 13.97,53.98 v12.7,52.71
  Top 0.406: U$7.P$2 86.36,36.83 | 86.36,36.83 86.36,28.57 85.72,27.94 U$9.P$2 | v86.36,41.27 86.36,36.83
  Bottom 0.279: v29.21,49.53 29.21,50.8 v33.02,54.61 | v12.7,52.71 9.53,52.71 8.26,51.44 8.26,47.62 8.89,46.99 8.89,45.72 11.43,43.18 11.43,41.27 10.79,40.64 JP8.9
  Bottom 0.406: JP9.3 50.16,46.99 48.9,48.26 48.9,57.79 49.53,58.42 52.71,58.42 53.34,59.05 53.34,63.5 54.61,64.77 65.41,64.77 66.04,65.41 77.47,65.41 78.74,64.13 78.74,60.96 81.36,58.34 85.32,58.34 86.36,57.15 v86.36,41.27
SDA  (via drill 0.35)
  Top 0.279: JP9.4 46.36,49.53 44.27,47.45 U2.44 30.66,47.45 30.48,47.62 30.48,50.8 31.11,51.44 v34.93,51.44 | v34.93,55.88 33.02,55.88 31.75,54.61 8.89,54.61 v6.99,52.71
  Top 0.406: JP9.4 53.34,49.53 55.25,51.44 69.85,51.44 v73.66,47.62 | v74.93,40.01 74.93,36.83 76.2,35.56 79.44,35.56 | 79.44,35.56 U$7.P$3 | U$9.P$3 80,26.68 79.38,27.3 79.38,35.5 79.44,35.56
  Bottom 0.279: v34.93,51.44 v34.93,55.88 | v6.99,52.71 6.99,46.99 8.26,45.72 8.26,45.09 9.53,43.82 JP8.11
  Bottom 0.406: v73.66,47.62 73.66,41.27 v74.93,40.01
STEP1
  Top 0.279: U2.1 18.14,34.65 17.78,34.29 15.88,34.29 15.24,33.66 15.24,31.11 15.88,30.48 JP3.7
STEP2
  Top 0.279: U2.15 25.12,27.58 26.04,26.67 31.75,26.67 35.56,30.48 JP4.7
STEP3  (via drill 0.35)
  Top 0.279: U2.17 26.14,32.28 26.67,31.75 32.39,31.75 34.93,34.29 38.73,34.29 39.37,33.66 39.37,31.75 v40.64,30.48
  Top 0.406: v52.71,26.67 54.61,26.67 55.25,27.3 55.25,29.84 55.88,30.48 JP7.7
  Bottom 0.406: v40.64,30.48 43.82,30.48 45.09,29.21 51.87,29.21 52.68,28.4 52.68,26.69 v52.71,26.67
TX0  (via drill 0.35)
  Top 0.279: U2.3 19.13,35.48 20.32,34.29 20.32,29.21 v21.59,27.94
  Top 0.406: JP1.1 49.66,10.03 50.8,8.89 52.71,8.89 53.34,9.53 53.34,12.7 53.98,13.34 59.69,13.34 62.23,15.88 62.23,28.57 v60.96,29.84 | v74.93,43.18 78.1,46.36 JP12.2 | v13.34,16.51 21.59,16.51 26.67,21.59 32.39,21.59 34.93,24.13 39.37,24.13 40.64,25.4 v40.64,26.04
  Bottom 0.406: v60.96,29.84 71.12,40.01 71.12,51.44 71.75,52.07 73.02,52.07 74.93,50.16 v74.93,43.18 | v21.59,27.94 20.32,29.21 13.34,29.21 12.06,27.94 12.06,17.78 v13.34,16.51 | v40.64,26.04 40.64,25.4 40.01,24.76 40.01,3.81 40.64,3.17 50.16,3.17 51.44,4.45 51.44,8.26 49.53,10.16 49.53,11.3 JP1.1
TX1  (via drill 0.35)
  Top 0.279: U2.46 42.72,48.44 45.09,50.8 52.71,50.8 53.98,52.07 70.48,52.07 v72.39,50.16
  Top 0.406: v74.93,19.05 80.61,19.05 U$10.P$2
  Bottom 0.406: v72.39,50.16 72.39,39.37 74.93,36.83 v74.93,19.05
VCC
  Bottom 0.305: 33.66,37.47 27.3,37.47
  Bottom 0.406: 52.71,37.47 54.61,38.1 | 60.87,55.34 60.93,55.28 | 60.72,55.34 60.87,55.34 | 60.87,55.34 64.04,55.34 64.77,54.61 | 62.23,57.15 62.23,55.25 61.59,54.61 | 60.8,55.28 60.93,55.28 | 60.93,55.28 61.59,54.61 | 61.59,54.61 62.23,53.98 | 60.67,55.28 60.8,55.28 | 60.8,55.28 60.87,55.34 | 60.93,55.28 62.25,55.28 62.92,54.61 | 57.15,42.55 59.05,44.45 59.05,47.62 57.15,45.72 57.15,42.55 | 57.15,42.55 57.15,41.91 | 22.86,60.33 22.91,60.96 X4.2
  Bottom 2.54: JP2.1 32.39,15.24 33.66,16.51 33.66,37.47 | JP5.1 52.71,15.24 54.61,17.14 54.61,38.1 | 62.23,60.91 X2.1 | JP6.1 75.56,15.24 76.83,16.51 76.83,51.44 73.66,54.61 64.77,54.61 | 63.5,54.61 64.77,54.61 | 61.59,54.61 62.92,54.61 63.5,54.61 | 63.5,54.61 63.5,57.15 | 62.23,57.15 64.77,54.61
  Bottom 5.08: 62.23,60.91 62.23,57.15 60.67,55.28 59.05,53.34 59.05,47.62 59.05,42.55 54.61,38.1 | 52.71,37.47 27.3,37.47 23.49,41.27 23.49,53.98 22.86,55.25 22.86,60.33
XTAL1
  Top 0.279: U2.34 32.92,42.44 36.83,46.36 45.09,46.36 48.26,43.18 55.88,43.18 58.42,45.72 59.05,45.72 59.69,46.36 59.69,46.77 C2.2
  Top 0.406: C2.2 64.47,46.99 Q1.2
XTAL2
  Top 0.279: U2.33 33.71,41.96 37.47,45.72 43.18,45.72 48.26,40.64 59.05,40.64 59.69,41.27 59.69,42.33 C1.2
  Top 0.406: C1.2 63.55,42.55 Q1.1

### Text on the board
tNames: ICSP | 1 | + | - | + | - | SWITCH | BLK | CHARGING | FATHOM-S | By Alex W | FTDI | A5 | SDA | GRN | A4 | SCL | MPU6050 | A3 | D14 | ATMEGA2560 | PRESSURE | A2 | D15 | A1 | 5V | GND | GND | GND | A0 | GND | COMPASS | Underwater glider / Control board v0.2.1 | GPS | VMOT | VMOT | VMOT | BATT | + | - | PITCH | ROLL | ENGINE
bNames: + | - | + | - | CHARGING | FATHOM-S | SWITCH | D4 STEP | D6 STEP | D8 STEP | D5 DIR | D30 END | D7 DIR | D31 END | D9 DIR | D32 END | BATT | + | - | PITCH | ROLL | ENGINE